# Altium schematic sheet Battery Heating System.SchDoc
size A4; SheetNumber: 2; SheetTotal: 4
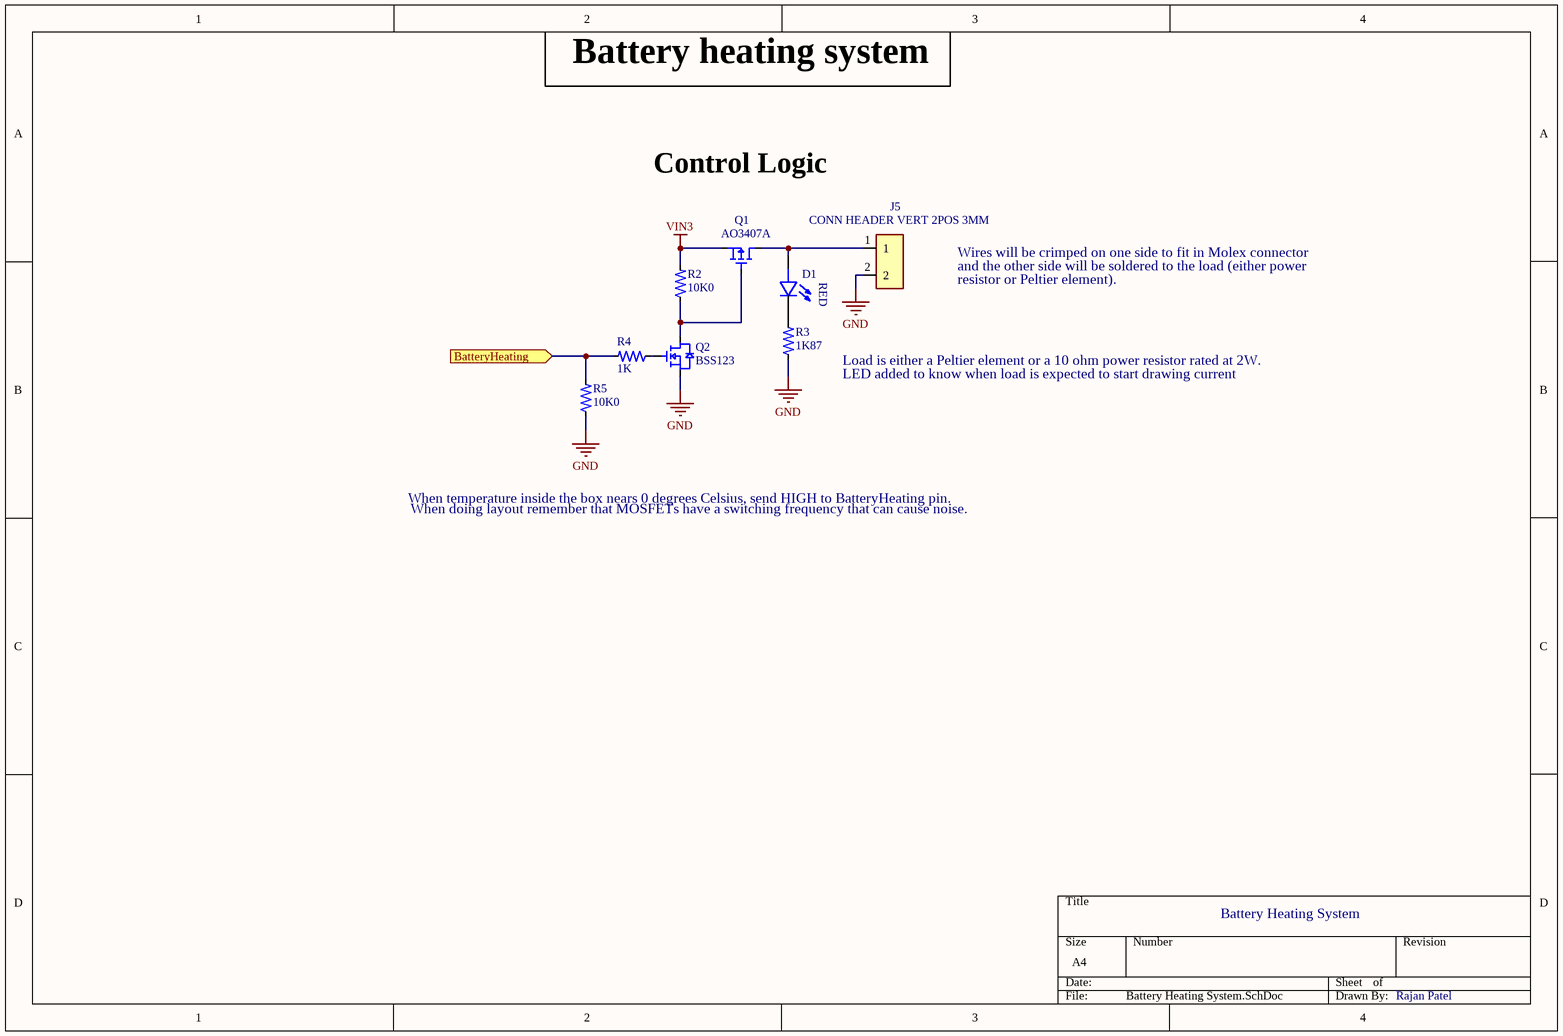
[diagram p0: Battery Heating System.SchDoc]

## Parts
D1  LED 0805  [LED_0805]  (value not drawn)
J5  CONN HEADER VERT 2POS 3MM  [CONN HEADER VERT 2POS 3MM]
Q1  AO3407A  [AO3407A]
Q2  BSS123  [BSS123]
R2  10K0  [res 0805]
R3  1K87  [res 0805]
R4  1K  [res 0805]
R5  10K0  [res 0805]

## Ports
BatteryHeating (in, see MCU, Radios, and Sensors[4C])

## Nets
GND: J5.2 Q2.2(Source) R3.1 R5.1
VIN3: Q1.2(Source) R2.2
BatteryHeating: R4.2 R5.2 ; port BatteryHeating
NetD1_1: D1.1(C) R3.2
NetD1_2: D1.2(A) J5.1 Q1.3(Drain)
NetQ1_1: Q1.1(Gate) Q2.3(Drain) R2.1
NetQ2_1: Q2.1(Gate) R4.1

## Notes on the sheet
- Battery heating system
- Control Logic
- Wires will be crimped on one side to fit in Molex connector
- and the other side will be soldered to the load (either power
- resistor or Peltier element).
- Load is either a Peltier element or a 10 ohm power resistor rated at 2W.
- LED added to know when load is expected to start drawing current
- When doing layout remember that MOSFETs have a switching frequency that can cause noise.
- When temperature inside the box nears 0 degrees Celsius, send HIGH to BatteryHeating pin.
- Battery Heating System
- Rajan Patel
- (in symbol LED 0805) RED

## Library data of the parts
D1 = LED 0805: Red LED Indication - Discrete 1.7V 0805 (2012 Metric); MP: 7012X1; Package: None; Availability: Unavailable; Value: *; Price: None
J5 = 0436500228: Rectangular Power Connector, 2 Contact(s), Female, Solder Terminal; Manufacturer Part Number: 43650-0228; Manufacturer Series: 43650; MF: Molex; MP: 0436500200; Connector Type: Power,Rectangular; Number of Contacts: 2; Option: General Purpose; Contact Style: SQ PIN-SKT; Durability: 30Cycles; Empty Shell: No; Mating Information: MULTIPLE MATING PARTS AVAILABLE; Number Of Connectors: 1; Rated Current (Signal): 5A; Board Mounting Option: PEG; Body/Shell Style: RECEPTACLE; Contact Resistance: 10mR; Dielectric Withstanding Voltage (AC): 1.5kV; Insertion Force-Max: 8.0064N; Insulation Resistance: 1GR; Polarization Key: POLARIZED HOUSING; Withdrawl Force-Min: 3.614N; Mating Contact Pitch: 0.118inch; Mounting Option 1: POLARIZED LCK; Mounting Option 2: LOCKING; Plating Thickness: 15uin; Body Breadth: 0.219inch; Body Depth: 0.39inch; Body Length: 0.38inch; Reference Standard: UL; Reliability: COMMERCIAL; SnapEDA_Link: https://www.snapeda.com/parts/0436500200/Molex/view-part/552556/?ref=snap; Price: None; Availability: Unavailable; Package: None; Value: *; Supplier: Mouser; Supplier Part Number: 538-43650-0228; Manufacturer: Molex; RoHS: Yes; Category: Headers and Wire Housings; Stock: 12783; Pricing: 1=0.78, 10=0.537, 50=0.537, 100=0.537, 1000=0.536, 10000=0.473 (USD); Mounting Technology: Board; Contact Finish - Mating: AU; Insulation Color: Black; Insulation Material: Polymer; Shell Material: Polymer; Contact Material: Brass; Contact Finish - Termination: TIN/LEAD OVER NICKEL; Min Operating Temperature: -40°C; Max Operating Temperature: 105°C; Contact Gender: Male; Termination: Solder; Contact Pattern: RECTANGULAR; Filter Feature: No; Mixed Contacts: No; Mounting Style: STRAIGHT; Number of Rows Loaded: 1; Number Of PCB Rows: 1; PCB Contact Pattern: RECTANGULAR; Terminal Length: 0.125inch; Terminal Pitch: 2.9972mm; Flammability Rating: UL94 V-0; Reach SVHC Compliant: Yes; RoHS Compliant: Yes; DIN Conformance: No; IEC Conformance: No; MIL Conformance: No; ComponentLink1URL: https://datasheet.ciiva.com:443/pdfs/VipMasterIC/IC/MOLE/MOLES07498/MOLES07498-1.pdf?src-supplier=IHS+Markit; ComponentLink1Description: https://datasheet.ciiva.com:443/pdfs/VipMasterIC/IC/MOLE/MOLES07498/MOLES07498-1.pdf?src-supplier=IHS+Markit; ComponentLink2URL: https://datasheet.ciiva.com/13550/0436500228-pcb-headers-148884-13550297.pdf?src-supplier=Mouser; ComponentLink2Description: https://datasheet.ciiva.com/13550/0436500228-pcb-headers-148884-13550297.pdf?src-supplier=Mouser
Q1 = AO3407A: Small Signal Field-Effect Transistor, 4.3A I(D), 30V, 1-Element, P-Channel, Silicon, Metal-oxide Semiconductor FET; Manufacturer: Alpha & Omega Semiconductor; Package Body Material: Plastic; Drain-source On Resistance-Max: 48mR; Feedback Cap-Max (Crss): 90pF; Number of Elements: 1; Operating Mode: ENHANCEMENT MODE; Power Dissipation-Max (Abs): 1.4W; Transistor Application: SWITCHING; Qualification Status: Not Qualified; Supplier: Digikey; Supplier Part Number: 785-1006-1-ND; Manufacturer Part Number: AO3407A; RoHS: Yes; Category: MOSFETs; Stock: 856157; Pricing: 1=0.31, 10=0.22, 100=0.1112, 500=0.09854, 1000=0.07668 (USD); Pins: 3; Package Shape: Rectangular; Terminal Finish: Tin; Transistor Element Material: SILICON; Max Operating Temperature: 150°C; JESD-609 Code: e3; Polarity/Channel Type: P-CHANNEL; Drain Current-Max (Abs) (ID): 4.3A; Drain Current-Max (ID): 4.3A; DS Breakdown Voltage-Min: 30V; FET Technology: METAL-OXIDE SEMICONDUCTOR; JESD-30 Code: R-PDSO-G3; Moisture Sensitivity Level: 1; Package Style: SMALL OUTLINEMeter; Surface Mount: Yes; Terminal Form: Gull Wing; Terminal Position: DUAL; RoHS Compliant: Yes; Reach SVHC Compliant: Yes; ComponentLink1URL: https://datasheet.ciiva.com:443/pdfs/VipMasterIC/IC/ALOM/ALOMS01464/ALOMS01464-1.pdf?src-supplier=IHS+Markit; ComponentLink1Description: https://datasheet.ciiva.com:443/pdfs/VipMasterIC/IC/ALOM/ALOMS01464/ALOMS01464-1.pdf?src-supplier=IHS+Markit; ComponentLink2URL: https://datasheet.ciiva.com/940/ao3407a-940745.pdf?src-supplier=Digikey; ComponentLink2Description: https://datasheet.ciiva.com/940/ao3407a-940745.pdf?src-supplier=Digikey; ComponentLink3URL: https://datasheet.ciiva.com/940/ao3407a-940747.pdf?src-supplier=Digikey; ComponentLink3Description: https://datasheet.ciiva.com/940/ao3407a-940747.pdf?src-supplier=Digikey; ComponentLink4URL: https://datasheet.ciiva.com/18057/getdatasheetpartid-64436-18057110.pdf?src-supplier=Verical; ComponentLink4Description: https://datasheet.ciiva.com/18057/getdatasheetpartid-64436-18057110.pdf?src-supplier=Verical
Q2 = BSS123_1: Small Signal Field-Effect Transistor, 0.17A I(D), 100V, 1-Element, N-Channel, Silicon, Metal-oxide Semiconductor FET, TO-236; Manufacturer: ON Semiconductor / Fairchild; Package Body Material: Plastic; Drain Current-Max (ID): 170mA; Drain-source On Resistance-Max: 10R; Number of Elements: 1; Operating Mode: ENHANCEMENT MODE; Feedback Cap-Max (Crss): 6pF; Power Dissipation-Max (Abs): 360mW; Transistor Application: SWITCHING; Qualification Status: Not Qualified; Supplier: Digikey; Supplier Part Number: BSS123NCT-ND; Manufacturer Part Number: BSS123; RoHS: Yes; Category: MOSFETs; Stock: 15036; Pricing: 1=0.35, 10=0.246, 100=0.1244, 500=0.10144, 1000=0.07527 (USD); Pins: 3; Package Shape: Rectangular; Transistor Element Material: SILICON; Max Operating Temperature: 150°C; Polarity/Channel Type: N-CHANNEL; DS Breakdown Voltage-Min: 100V; FET Technology: METAL-OXIDE SEMICONDUCTOR; JESD-30 Code: R-PDSO-G3; Package Style: SMALL OUTLINEMeter; Surface Mount: Yes; Terminal Form: Gull Wing; Terminal Position: DUAL; Moisture Sensitivity Level: 1; Drain Current-Max (Abs) (ID): 170mA; RoHS Compliant: Yes; Reach SVHC Compliant: Yes; ComponentLink1URL: https://datasheet.ciiva.com:443/pdfs/VipMasterIC/IC/ONSM/ONSM-S-A0003158648/ONSM-S-A0003544094-1.pdf?src-supplier=IHS+Markit; ComponentLink1Description: https://datasheet.ciiva.com:443/pdfs/VipMasterIC/IC/ONSM/ONSM-S-A0003158648/ONSM-S-A0003544094-1.pdf?src-supplier=IHS+Markit
R2-R5 = Resistor 0805: MP: 2-2176053-2; Resistance: .39; Power_Rating: .25 W; MF: TE Connectivity; Tolerance: 1%; Package: 0805; Value: *; SnapEDA_Link: https://www.snapeda.com/parts/2-2176053-2/TE%20Connectivity/view-part/2214511/?ref=snap; Availability: Unavailable; Price: None; EU_RoHS_Compliance: Compliant with Exemptions